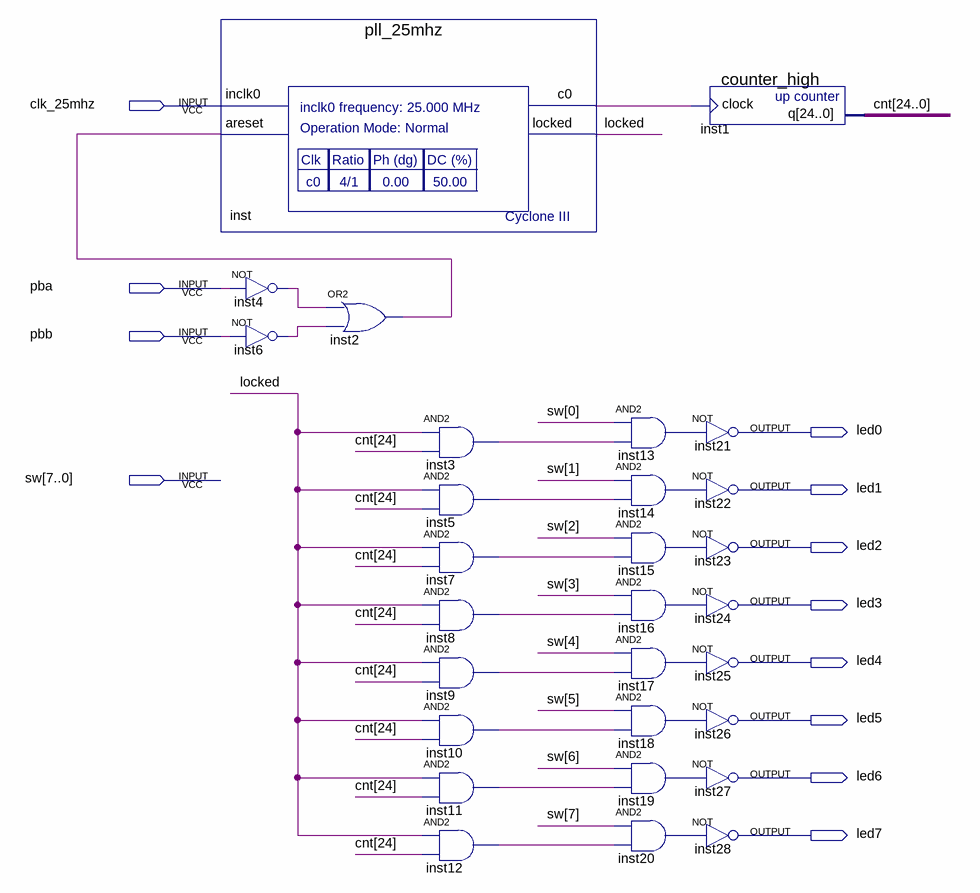
[diagram p0: schematic sheet]
// Quartus schematic test1.bdf as structural Verilog: 29 symbols, 12 pins
module test1 (
  input  clk_25mhz,
  input  pba,
  input  pbb,
  input  [7:0] sw,
  output led0,
  output led1,
  output led2,
  output led3,
  output led4,
  output led5,
  output led6,
  output led7
);

  wire inst2_out, inst3_out, inst4_out, inst5_out, inst6_out, inst7_out, inst8_out, inst9_out, inst10_out,
       inst11_out, inst12_out, inst13_out, inst14_out, inst15_out, inst16_out, inst17_out, inst18_out,
       inst19_out, inst20_out, inst_c0, locked;
  wire [24:0] cnt;

  pll_25mhz inst (.inclk0(clk_25mhz), .areset(inst2_out), .c0(inst_c0), .locked(locked));
  not inst4 (inst4_out, pba);
  not inst6 (inst6_out, pbb);
  or inst2 (inst2_out, inst4_out, inst6_out);
  and inst3 (inst3_out, locked, cnt[24]);
  and inst5 (inst5_out, locked, cnt[24]);
  and inst7 (inst7_out, locked, cnt[24]);
  and inst8 (inst8_out, locked, cnt[24]);
  and inst9 (inst9_out, locked, cnt[24]);
  and inst10 (inst10_out, locked, cnt[24]);
  and inst11 (inst11_out, locked, cnt[24]);
  and inst12 (inst12_out, locked, cnt[24]);
  and inst13 (inst13_out, sw[0], inst3_out);
  and inst14 (inst14_out, sw[1], inst5_out);
  and inst15 (inst15_out, sw[2], inst7_out);
  and inst16 (inst16_out, sw[3], inst8_out);
  and inst17 (inst17_out, sw[4], inst9_out);
  and inst18 (inst18_out, sw[5], inst10_out);
  and inst19 (inst19_out, sw[6], inst11_out);
  and inst20 (inst20_out, sw[7], inst12_out);
  counter_high inst1 (.clock(inst_c0), .q(cnt));
  not inst21 (led0, inst13_out);
  not inst22 (led1, inst14_out);
  not inst23 (led2, inst15_out);
  not inst24 (led3, inst16_out);
  not inst25 (led4, inst17_out);
  not inst26 (led5, inst18_out);
  not inst27 (led6, inst19_out);
  not inst28 (led7, inst20_out);
endmodule
